# Altium schematic sheet Mach khoa so dien tu - Bao.SchDoc
size A; SheetNumber: 1; SheetTotal: 1
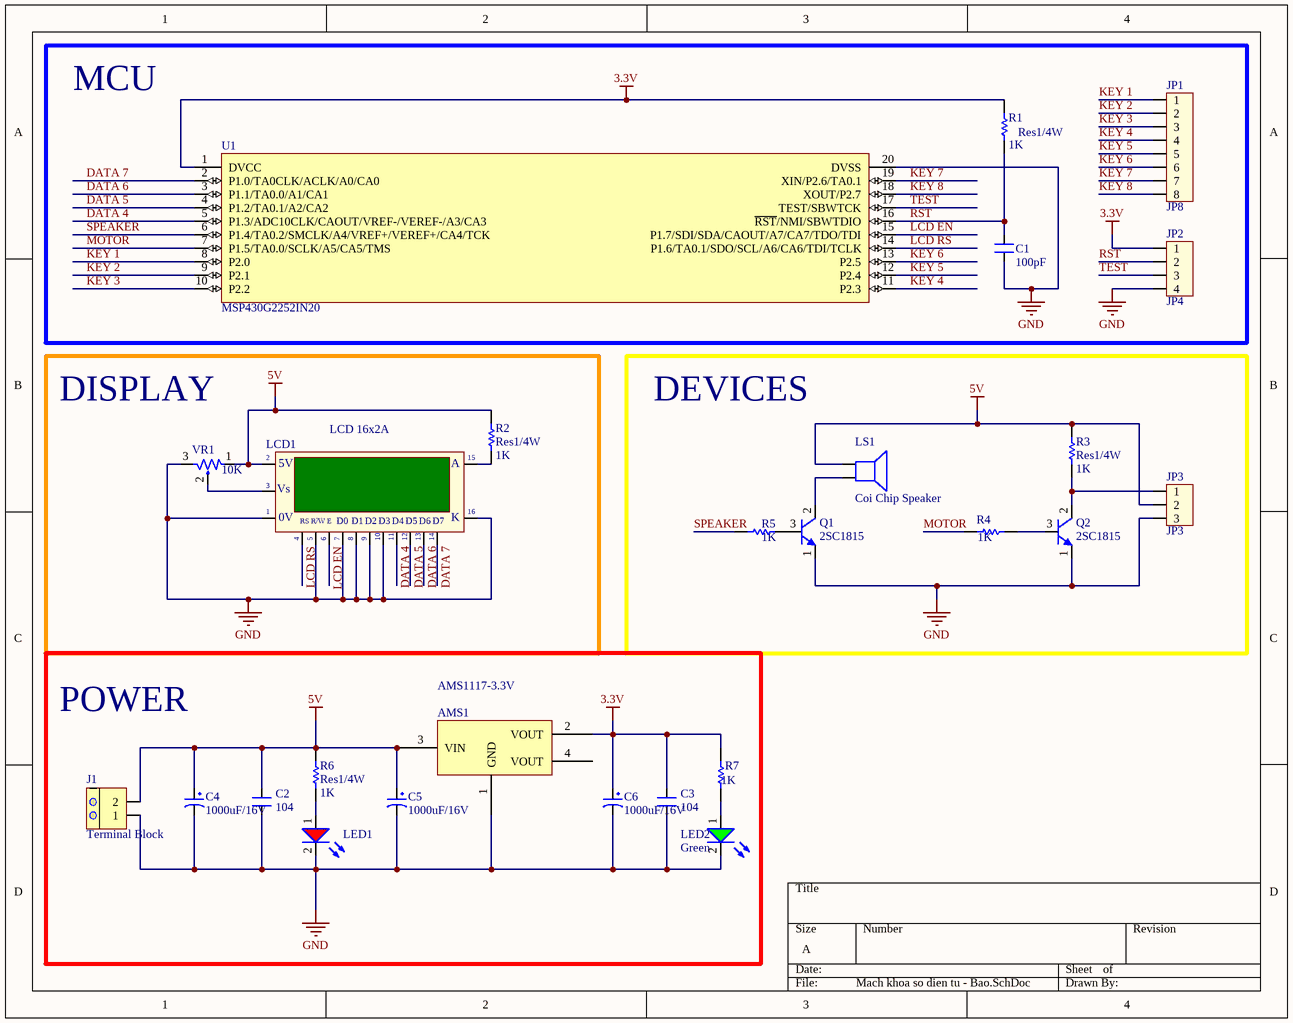
[diagram p0: Mach khoa so dien tu - Bao.SchDoc]

## Parts
AMS1  AMS1117-3.3V  [SOT223]
C1  100pF  [CN1]
C2  104  [CN2]
C3  104  [CN2]
C4  1000uF/16V  [CP1.5/3.4]
C5  1000uF/16V  [CP1.5/3.4]
C6  1000uF/16V  [CP1.5/3.4]
J1  value Terminal Block  [STB02]  (hidden comment: OSTTC-02-2162)
JP1  JP8  [CON8]
JP2  JP4  [CON4]
JP3  JP3  [CON3]
LCD1  LCD 16x2A  [LCD16x2]
LED1  RED LED 5mm  [LED5R]  (value not drawn)
LED2  value Green  [LED5G]  (hidden comment: LED_G_5)
LS1  Coi Chip Speaker  [Coi Chip Speacker]
Q1  2SC1815  [2SC1815]
Q2  2SC1815  [2SC1815]
R1  Res1/4W  value 1K  [CFR25S]
R2  Res1/4W  value 1K  [CFR25S]
R3  Res1/4W  value 1K  [CFR25S]
R4  value 1K  [CFR25S]  (hidden comment: Res1/4W)
R5  value 1K  [CFR25S]  (hidden comment: Res1/4W)
R6  Res1/4W  value 1K  [CFR25S]
R7  value 1K  [CFR25S]  (hidden comment: Res1/4W)
U1  MSP430G2252IN20  [MSP430G2552]
VR1  10K  [VR1]

## Blocks framed on the sheet
MCU: C1 JP1 JP2 R1 U1
DISPLAY: LCD1 R2 VR1
DEVICES: JP3 LS1 Q1 Q2 R3-R5
POWER: AMS1 C2-C6 J1 LED1 LED2 R6 R7

## Nets
3.3V: AMS1.2(VOUT) C3.2 C6.1 JP2.1 R1.2 R7.1 U1.1(DVCC)
5V: AMS1.3(VIN) C2.2 C4.1 C5.1 J1.2 JP3.2 LCD1.2(VDD) LS1.1 R2.2 R3.1 R6.1 VR1.1
GND: AMS1.1(GND) C1.2 C2.1 C3.1 C4.2 C5.2 C6.2 J1.1 JP2.4 JP3.3 LCD1.1(GND) LCD1.5(R/~{W}) LCD1.7(D0) LCD1.8(D1) LCD1.9(D2) LCD1.10(D3) LCD1.16(K) LED1.2(K) LED2.2(K) Q1.1(E) Q2.1(E) U1.20(DVSS) VR1.3
DATA 4: LCD1.11(D4) U1.5(P1.3/ADC10CLK/CAOUT/VREF-/VEREF-/A3/CA3)
DATA 5: LCD1.12(D5) U1.4(P1.2/TA0.1/A2/CA2)
DATA 6: LCD1.13(D6) U1.3(P1.1/TA0.0/A1/CA1)
DATA 7: LCD1.14(D7) U1.2(P1.0/TA0CLK/ACLK/A0/CA0)
KEY 1: JP1.1 U1.8(P2.0)
KEY 2: JP1.2 U1.9(P2.1)
KEY 3: JP1.3 U1.10(P2.2)
KEY 4: JP1.4 U1.11(P2.3)
KEY 5: JP1.5 U1.12(P2.4)
KEY 6: JP1.6 U1.13(P2.5)
KEY 7: JP1.7 U1.19(XIN/P2.6/TA0.1)
KEY 8: JP1.8 U1.18(XOUT/P2.7)
LCD EN: LCD1.6(~{EN}) U1.15(P1.7/SDI/SDA/CAOUT/A7/CA7/TDO/TDI)
LCD RS: LCD1.4(RS) U1.14(P1.6/TA0.1/SDO/SCL/A6/CA6/TDI/TCLK)
MOTOR: R4.1 U1.7(P1.5/TA0.0/SCLK/A5/CA5/TMS)
RST: C1.1 JP2.2 R1.1 U1.16(~{RST}/NMI/SBWTDIO)
SPEAKER: R5.1 U1.6(P1.4/TA0.2/SMCLK/A4/VREF+/VEREF+/CA4/TCK)
TEST: JP2.3 U1.17(TEST/SBWTCK)
NetJP3_1: JP3.1 Q2.2(C) R3.2
NetLCD1_3: LCD1.3(VEE) VR1.2
NetLCD1_15: LCD1.15(A) R2.1
NetLED1_1: LED1.1(A) R6.2
NetLED2_1: LED2.1(A) R7.2
NetLS1_2: LS1.2 Q1.2(C)
NetQ1_3: Q1.3(B) R5.2
NetQ2_3: Q2.3(B) R4.2

Not connected (* = marked no-connect by the designer): AMS1 4(VOUT)

## Notes on the sheet
- (in symbol LCD16x2A) 5V; Vs; |; 0V; R/W; E

## Library data of the parts
AMS1 = AMS1117 SMD: Dán; Value: AMS1117-3.3V SOT223; Don_Vi: Con; Ma_Hang: MH000596; Ghi_Chu: *; Kieu_Chan: *; Chung_Loai: Dán
C1 = CN1: Cap np  1pF - 472pF; Value: 100pF
C2 C3 = CN2: Cap np 104 => 105pF; Value: 0.1uF
C4-C6 = CP4: Cap 1000uF/16V - 220uF/50V; Description 5: 4,7uF>10uF/250V_3,3uF>10uF/400V - 2,2uF>4,7uF/450V; Description 1: 2200uF-3300uF/6,3V - 1000uF-2200uF/10V; Description 2: 1000uF/16V - 470uF => 1000uF/25V - 100uF/100V; Description 3: 330uF>470uF/35V_220uF>470uF/50V_10uF>22uF/250V; Description 4: 220uF => 330uF/63V - 10uF =>33uF/160 - 200V; Value: 1000uF/16V
J1 = OSTTC-02-2162: Terminal Block 2 Poles 5.08mm Blue; ComponentLink1Description: Datasheet; ComponentLink1URL: D:\Dropbox\Datasheets\Passive Components\Connectors\OSTTC-XX-2162.pdf; Unit Price: 0.076
JP1 = Con8: Connector 8; Value: Connector 8
JP2 = Con4: Connector 4; Value: Connector 4
JP3 = Con3: Connector 3; Value: Connector 3
LCD1 = LCD16x2A: LCD dipslay 16 char, 2 line; Value: LCD16x2A
LED1 = LED_RED_5MM_1: LED Red 5mm; Manufacturer: Broadcom Limited; Cost (VNĐ): 1000; Lens Transparency: Clear; Millicandela Rating: 60mcd; Lens Style/Size: Round with Domed Top, 5mm (T-1 3/4), 4.83mm; Voltage - Forward (Vf) (Typ): 1.9V; Current - Test: 10mA; Viewing Angle: 35°; Wavelength - Dominant: 626nm; Wavelength - Peak: 635nm; BuyLink: http://www.tme.vn/Product.aspx?id=1277#page=pro_info; Value: RED LED 5mm; Supplier 1: Digi-Key; Supplier Part Number 1: 516-1335-ND; Manufacturer Part Number: HLMP-3316; RoHS: RoHS Compliant; Category: Optoelectronics; Stock 1: 11943; Pricing 1: 1=0.41, 10=0.294, 25=0.24, 100=0.192, 250=0.162, 500=0.138, 1000=0.108, 2500=0.099 (USD); Packaging: Bulk; Part Status: Active; Color: Red; Lens Color: Red; Mounting Type: Through Hole; Features: -; Package / Case: Radial; Supplier Device Package: T-1 3/4; Size / Dimension: -; Height (Max): 9.19mm; ComponentLink1URL: https://docs.broadcom.com/docs/AV02-1023EN; ComponentLink1Description: https://docs.broadcom.com/docs/AV02-1023EN
LED2 = LED_GREEN_5MM: LED Green 5mm; ComponentLink1Description: Datasheet; ComponentLink1URL: D:\Dropbox\Datasheets\Opto and Illumination\LEDs\SMD LED.pdf; Unit Price: 0.0476
LS1 = Coi Chip Speaker: Còi chip
Q1 Q2 = 2SC1815: Trans NPN 50V 150mA TO-92; ComponentLink1Description: Datasheet; ComponentLink1URL: D:\Dropbox\Datasheets\Transistors\P Channel Bipolar\2SC1815.pdf; Unit Price: 0.0143
R1-R7 = Res1/4W: Resistor; Published: 8-Jun-2000; LatestRevisionDate: 17-Jul-2002; LatestRevisionNote: Re-released for DXP Platform.; PackageReference: AXIAL-0.3; Publisher: Altium Limited; PackageDescription: Axial Device, Thru-Hole; 2 Leads; 0.3 in Pin Spacing
U1 = MSP430G2252IN20: MCU 16bit 16KB 1.8-3.6V 16MHz DIP20; ComponentLink1Description: Datasheet; ComponentLink1URL: D:\Dropbox\Datasheets\Microcontrolers\MSP430\MSP430x2xx Family\MSP430G2553.pdf; Unit Price: 1.0000
VR1 = VR2: Var Resistor; Value: VR 10K